# Altium project PB2_AdapterBoard_Rev0.PrjPcb
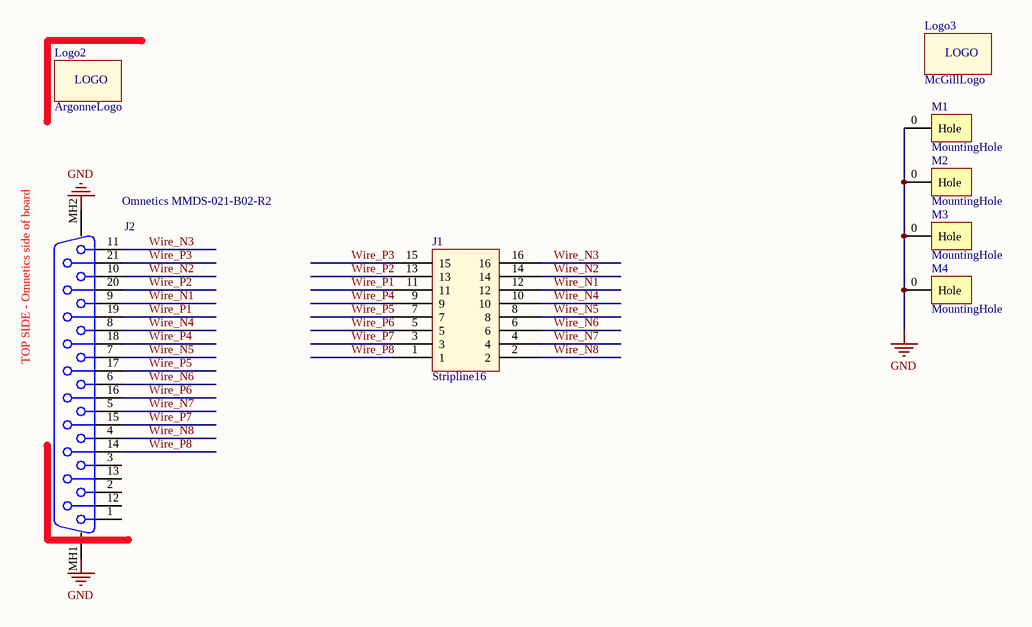
[diagram p0: PB2_AdapterBoard_Rev0.SchDoc]
1 sheet, 8 parts. Net scope: global (net labels, ports and power ports of the same name join across sheets).
Board file: PB2_AdapterBoard_Rev0.PcbDoc

## Sheet PB2_AdapterBoard_Rev0.SchDoc
size A; PageSetup: Record=PageOptions|CenterHorizontal=True|CenterVertical=True|PrintScale=1.09|XCorrection=1.00|YCorrection=1.00|PrintKind=0|BorderSize=5000000|LeftOffset=0|BottomOffset=0|Orientation=2|PaperLength=1000|PaperWidth=1000|Scale=100|PaperSource=7|PrintQuality=-3|MediaType=1|DitherType=10|PrintScaleMode=1|PaperKind=Letter|PaperIndex=1

### Parts
J1  Stripline16  [Stripline16-HalfLength]
J2  Omnetics MMDS-021-B02-R2  [MMDS-021-B02-R2]
Logo2  ArgonneLogo  [ArgonneLogo]  (no BOM)
Logo3  McGillLogo  [McGillLogo1]  (no BOM)
M1  MountingHole  [MountingHole]
M2  MountingHole  [MountingHole]
M3  MountingHole  [MountingHole]
M4  MountingHole  [MountingHole]

### Nets
GND: J2.MH1 J2.MH2 M1.0(Hole) M2.0(Hole) M3.0(Hole) M4.0(Hole)
Wire_N1: J1.12 J2.9
Wire_N2: J1.14 J2.10
Wire_N3: J1.16 J2.11
Wire_N4: J1.10 J2.8
Wire_N5: J1.8 J2.7
Wire_N6: J1.6 J2.6
Wire_N7: J1.4 J2.5
Wire_N8: J1.2 J2.4
Wire_P1: J1.11 J2.19
Wire_P2: J1.13 J2.20
Wire_P3: J1.15 J2.21
Wire_P4: J1.9 J2.18
Wire_P5: J1.7 J2.17
Wire_P6: J1.5 J2.16
Wire_P7: J1.3 J2.15
Wire_P8: J1.1 J2.14

Not connected (* = marked no-connect by the designer): J2 1 2 3 12 13

### Notes on the sheet
- (near J2) TOP SIDE - Omnetics side of board
- (in symbol Logo) LOGO

### Library data of the parts
J1 = Stripline16: Stripline16 2mm x 15mm pads
J2 = OmneticsMicroD21
Logo2 Logo3 = Logo